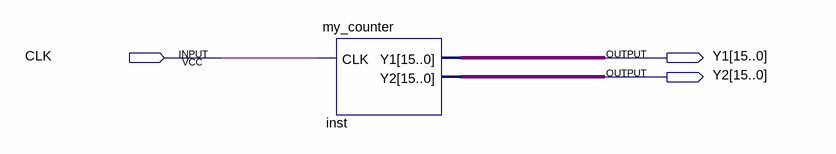
[diagram p0: schematic sheet]
// Quartus schematic behavioural.bdf as structural Verilog: 1 symbols, 3 pins
module behavioural (
  input  CLK,
  output [15:0] Y1,
  output [15:0] Y2
);

  my_counter inst (.CLK(CLK), .Y1(Y1), .Y2(Y2));
endmodule
